# EAGLE design mx 9 3s (EAGLE 9.6.2)
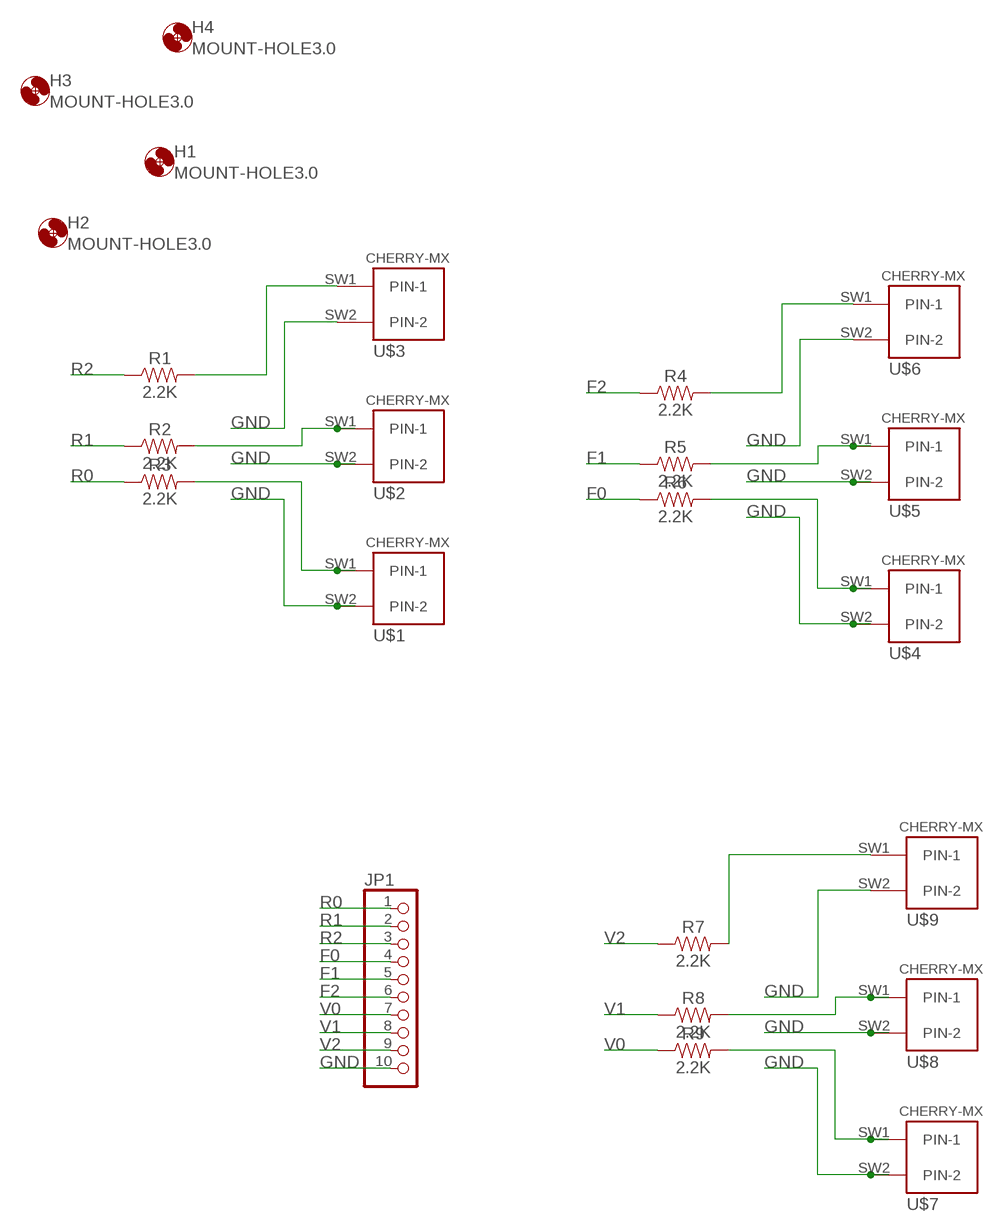
[diagram p0: schematic, sheet 1]

## Parts
H1  MOUNT-HOLE3.0  [3,0]
H2  MOUNT-HOLE3.0  [3,0]
H3  MOUNT-HOLE3.0  [3,0]
H4  MOUNT-HOLE3.0  [3,0]
JP1  PINHD-1X10  [1X10]
R1  2.2K  2.2KOHM-0402-1/16W-1%  [0402]
R2  2.2K  2.2KOHM-0402-1/16W-1%  [0402]
R3  2.2K  2.2KOHM-0402-1/16W-1%  [0402]
R4  2.2K  2.2KOHM-0402-1/16W-1%  [0402]
R5  2.2K  2.2KOHM-0402-1/16W-1%  [0402]
R6  2.2K  2.2KOHM-0402-1/16W-1%  [0402]
R7  2.2K  2.2KOHM-0402-1/16W-1%  [0402]
R8  2.2K  2.2KOHM-0402-1/16W-1%  [0402]
R9  2.2K  2.2KOHM-0402-1/16W-1%  [0402]
U$1  CHERRY-MX  [CHERRY-MX]
U$2  CHERRY-MX  [CHERRY-MX]
U$3  CHERRY-MX  [CHERRY-MX]
U$4  CHERRY-MX  [CHERRY-MX]
U$5  CHERRY-MX  [CHERRY-MX]
U$6  CHERRY-MX  [CHERRY-MX]
U$7  CHERRY-MX  [CHERRY-MX]
U$8  CHERRY-MX  [CHERRY-MX]
U$9  CHERRY-MX  [CHERRY-MX]

## Nets
F0: JP1.4 R6.1
F1: JP1.5 R5.1
F2: JP1.6 R4.1
GND: JP1.10 U$1.SW2(PIN-2) U$2.SW2(PIN-2) U$3.SW2(PIN-2) U$4.SW2(PIN-2) U$5.SW2(PIN-2) U$6.SW2(PIN-2) U$7.SW2(PIN-2) U$8.SW2(PIN-2) U$9.SW2(PIN-2)
K0: R3.2 U$1.SW1(PIN-1)
K1: R2.2 U$2.SW1(PIN-1)
K2: R1.2 U$3.SW1(PIN-1)
K3: R4.2 U$6.SW1(PIN-1)
K4: R5.2 U$5.SW1(PIN-1)
K5: R6.2 U$4.SW1(PIN-1)
K6: R7.2 U$9.SW1(PIN-1)
K7: R8.2 U$8.SW1(PIN-1)
K8: R9.2 U$7.SW1(PIN-1)
R0: JP1.1 R3.1
R1: JP1.2 R2.1
R2: JP1.3 R1.1
V0: JP1.7 R9.1
V1: JP1.8 R8.1
V2: JP1.9 R7.1

## Library data of the parts
H1-H4 = holes:MOUNT-HOLE: MOUNTING HOLE with drill center marker
JP1 = pinhead:PINHD-1X10: PIN HEADER
R1-R9 = SparkFun-Resistors:2.2KOHM: 2.2kΩ resistor A resistor is a passive two-terminal electrical component that implements electrical resistance as a circuit element. Resistors act to reduce current flow, and, at the same time, act to lower voltage levels within circuits. - Wikipedia; PROD_ID: RES-14341
U$1-U$9 = cherrymxhs:CHERRY-MX: Cherry MX series keyswitch

## Board
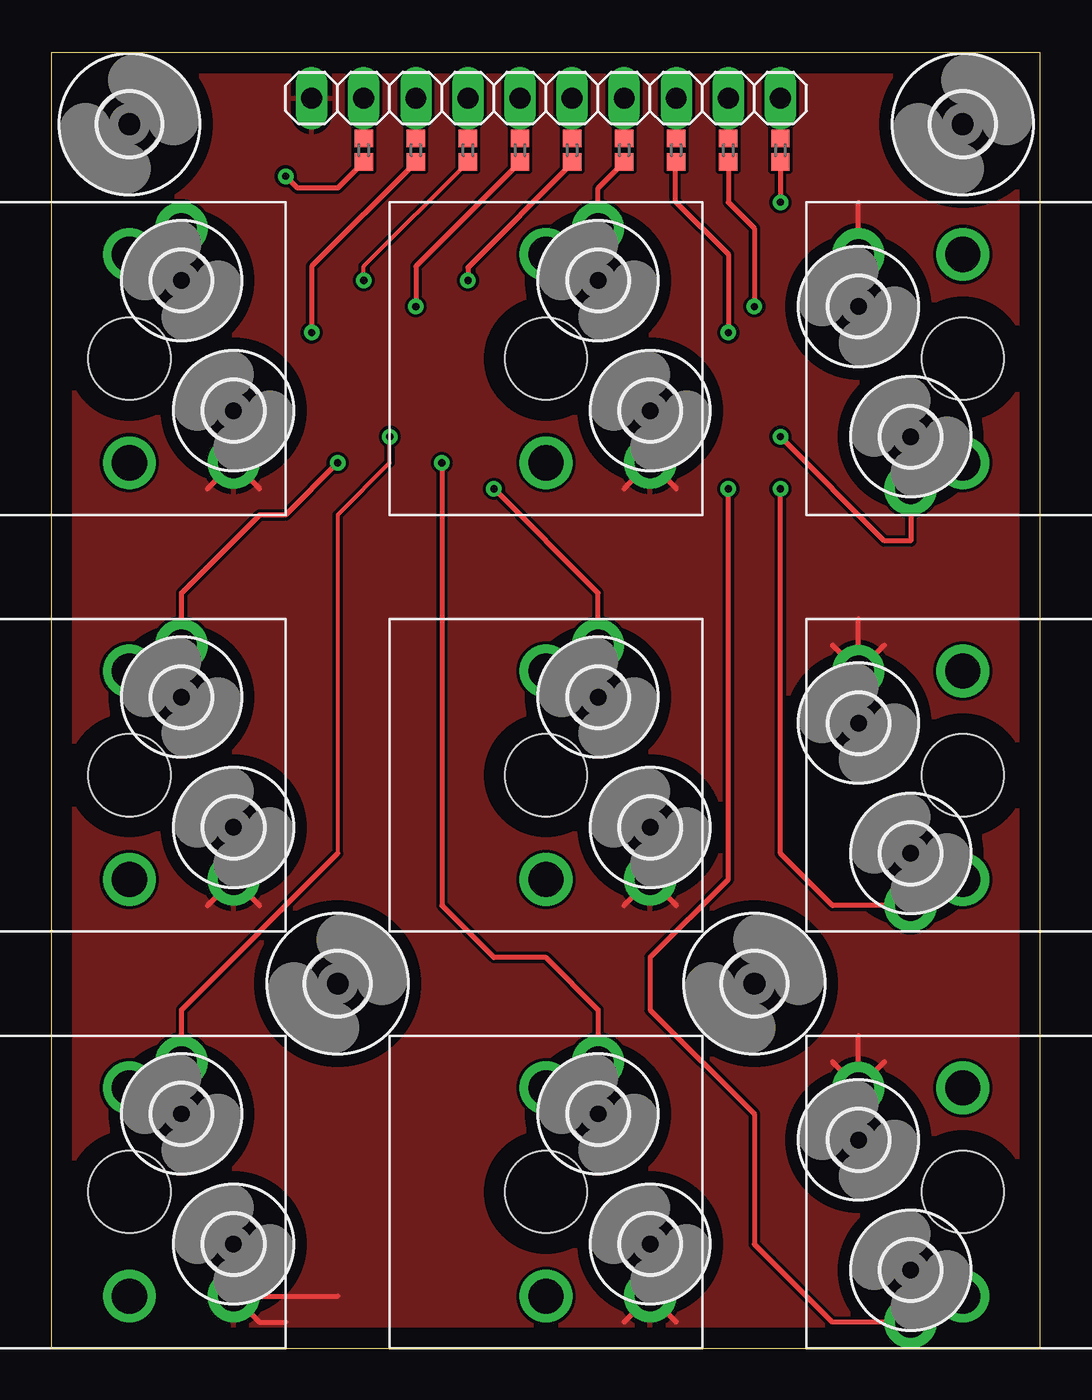
[diagram p1: board, top side]
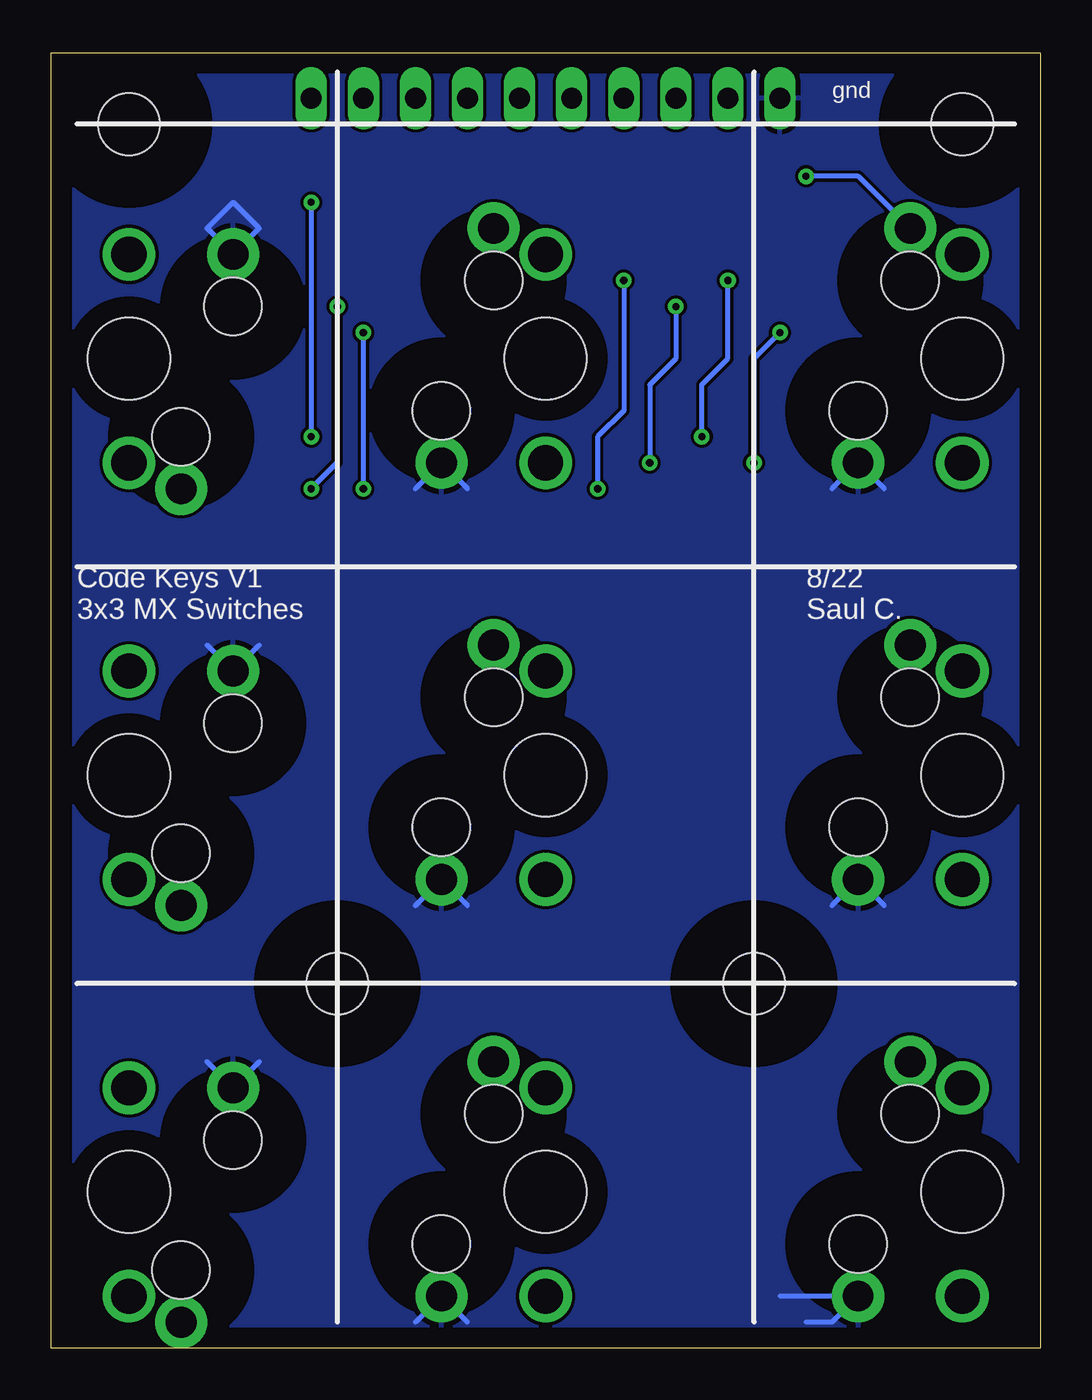
[diagram p2: board, bottom side, seen from below]

Size 48.24 x 63.17 mm. Coordinates in mm from the lower left corner, seen from the top.
Outline: 0,0 48.24,0 48.24,63.17 0,63.17 0,0
Copper layers (1*16): Top 0.035mm / dielectric 1.5mm / Bottom 0.035mm
Design rules "default": minimum track width 6mil, minimum drill 0.35mm, track to track 6mil, track to pad 6mil, pad to pad 6mil, via to via 6mil, smd to smd 6mil, copper to edge 40mil, drill to drill 6mil, minimum pad ring 10mil, minimum via ring 8mil, stop-mask expansion 4mil, vias tented up to drill 0mil, thermal gap 10mil

### Footprints (pad centres in the part's own frame; a part is rotated, then mirrored left to right if it is on the bottom)
3,0 = hole 3: 0,0
1X10 = drill 1.016 long: 1 -11.43,0; 2 -8.89,0; 3 -6.35,0; 4 -3.81,0; 5 -1.27,0; 6 1.27,0; 7 3.81,0; 8 6.35,0; 9 8.89,0; 10 11.43,0
0402 = smd 0.85 x 0.9: 1 -0.58,0; 2 0.58,0
CHERRY-MX = drill 1.714 pad 1.93: P$3 -5.08,0; P$4 5.08,0 | drill 1.5 pad 2.54: SW1 -6.35,2.54; SW2 5.08,5.08 | hole 4: 0,0 | hole 2.8: -3.81,2.54; 2.54,5.08

### Placement (x,y rotation side)
H1  3.81,59.69 0 top
H2  44.45,59.69 0 top
H3  13.97,17.78 0 top
H4  34.29,17.78 0 top
JP1  24.13,60.96 180 top
R1  30.48,58.42 270 top
R2  33.02,58.42 270 top
R3  35.56,58.42 270 top
R4  22.86,58.42 270 top
R5  25.4,58.42 270 top
R6  27.94,58.42 270 top
R7  15.24,58.42 270 top
R8  17.78,58.42 270 top
R9  20.32,58.42 270 top
U$1  44.45,48.26 90 top
U$2  44.45,27.94 90 top
U$3  44.45,7.62 90 top
U$4  24.13,48.26 270 top
U$5  24.13,27.94 270 top
U$6  24.13,7.62 270 top
U$7  3.81,7.62 270 top
U$8  3.81,27.94 270 top
U$9  3.81,48.26 270 top

### Tracks (layer width: path | path; a pad name or v marks a point on that pad's centre or on a via)
F0
  Top 0.254: R6.1 JP1.4
F1
  Top 0.254: R5.1 JP1.5
F2
  Top 0.254: R4.1 JP1.6
GND
  Top 0.254: 7.62,21.59 U$8.SW2 10.16,21.59 | 10.16,41.91 U$9.SW2 7.62,41.91 | 30.48,41.91 U$4.SW2 27.94,41.91 | 27.94,21.59 U$5.SW2 30.48,21.59 | U$3.SW2 40.64,13.97 | U$3.SW2 39.37,15.24 | U$3.SW2 38.1,13.97 | U$2.SW2 39.37,35.56 | U$2.SW2 40.64,34.29 | U$2.SW2 38.1,34.29 | U$1.SW2 39.37,55.88 | 30.48,1.27 U$6.SW2 27.94,1.27 | 13.97,2.54 U$7.SW2 10.16,1.27 11.43,1.27
  Bottom 0.254: 30.48,1.27 U$6.SW2 27.94,1.27 | 40.64,13.97 U$3.SW2 38.1,13.97 | 30.48,21.59 U$5.SW2 27.94,21.59 | 12.7,2.54 U$7.SW2 10.16,1.27 11.43,1.27 | 30.48,41.91 U$4.SW2 27.94,41.91 | 7.62,41.91 U$9.SW2 10.16,41.91 | 7.62,21.59 U$8.SW2 10.16,21.59 | 40.64,34.29 U$2.SW2 38.1,34.29 | U$1.SW2 38.1,54.61 39.37,55.88 40.64,54.61 U$1.SW2
  pour Bottom: -3.17,68.58 60.96,68.58 60.96,-6.35 -7.62,-6.35 -7.62,64.14
  pour Top: -1.27,69.85 64.77,69.85 66.04,68.58 66.04,5.08 58.42,-2.54 -3.81,-2.54 -7.62,1.27 -7.62,69.85 -6.35,71.12
K0  (via drill 0.35)
  Top 0.254: U$1.SW1 41.91,39.37 40.64,39.37 v35.56,44.45 | R3.2 v35.56,55.88
  Bottom 0.254: v35.56,55.88 v35.56,44.45
K1  (via drill 0.35)
  Top 0.254: U$2.SW1 38.1,21.59 35.56,24.13 v35.56,41.91 | R2.2 33.02,55.88 34.29,54.61 v34.29,50.8
  Bottom 0.254: v34.29,50.8 34.29,43.18 v35.56,41.91
K2  (via drill 0.35)
  Top 0.254: R1.2 30.43,57.78 30.43,55.94 33.02,53.34 v33.02,49.53 | U$3.SW1 38.1,1.27 34.29,5.08 34.29,11.43 29.21,16.51 29.21,19.05 33.02,22.86 v33.02,41.91
  Bottom 0.254: v33.02,41.91 v33.02,49.53
K3  (via drill 0.35)
  Top 0.254: U$6.SW1 26.67,16.51 24.13,19.05 21.59,19.05 19.05,21.59 v19.05,43.18 | R4.2 17.78,52.76 v17.78,50.8
  Bottom 0.254: v17.78,50.8 17.78,48.26 19.05,46.99 v19.05,43.18
K4  (via drill 0.35)
  Top 0.254: R5.2 25.4,57.78 20.32,52.7 v20.32,52.07 | U$5.SW1 26.67,36.83 v21.59,41.91
  Bottom 0.254: v21.59,41.91 21.59,44.45 20.32,45.72 v20.32,52.07
K5
  Top 0.254: U$4.SW1 26.67,56.57 R6.2
K6  (via drill 0.35)
  Top 0.254: R7.2 13.97,56.57 12.01,56.57 v11.43,57.15
  Bottom 0.254: U$9.SW1 8.89,57.15 v11.43,57.15
K7  (via drill 0.35)
  Top 0.254: R8.2 12.7,52.76 v12.7,49.53 | U$8.SW1 6.35,36.83 10.16,40.64 11.43,40.64 v13.97,43.18
  Bottom 0.254: v13.97,43.18 13.97,48.26 v12.7,49.53
K8  (via drill 0.35)
  Top 0.2: v15.24,52.07 15.24,52.76 R9.2 | 13.97,24.13 13.97,40.64 16.51,43.18 v16.51,44.45
  Top 0.254: U$7.SW1 6.35,16.51 13.97,24.13
  Bottom 0.254: v16.51,44.45 16.51,46.99 15.24,48.26 v15.24,52.07
R0
  Top 0.254: R3.1 JP1.1
R1
  Top 0.254: R2.1 JP1.2
R2
  Top 0.254: R1.1 JP1.3
V0
  Top 0.254: R9.1 JP1.7
V1
  Top 0.254: R8.1 JP1.8
V2
  Top 0.254: R7.1 JP1.9

### Text on the board
bPlace: gnd | 8/22 / Saul C. | Code Keys V1 / 3x3 MX Switches